# EAGLE design 16A-01 (EAGLE 6.3)
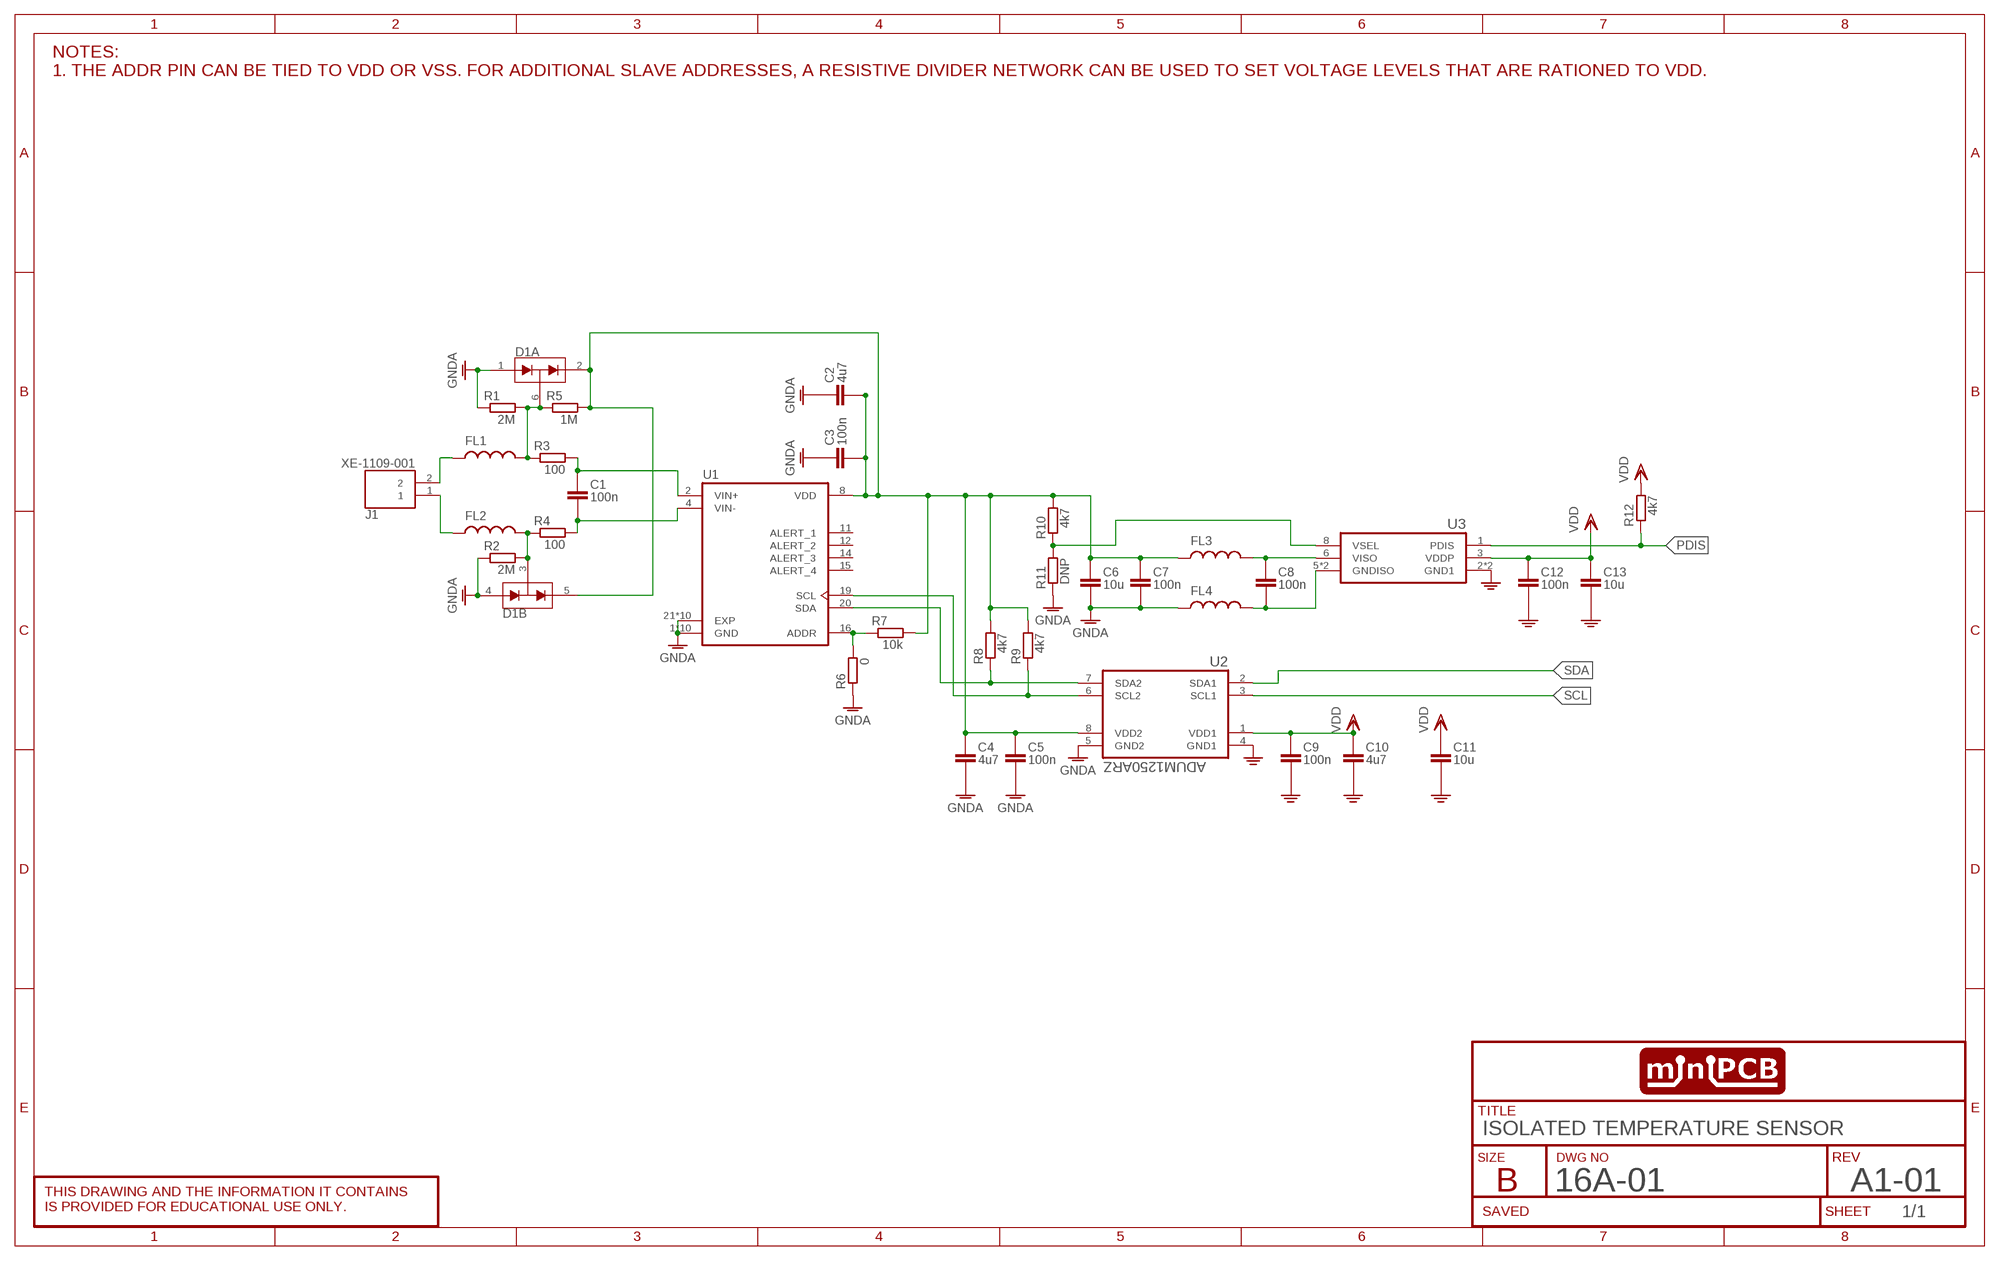
[diagram p0: schematic, sheet 1]
SHEET1 (SCHEMATIC): DWG_NO: 16A-01; REV: A1-01; TITLE: ISOLATED TEMPERATURE SENSOR

## Parts
C1  100n  CAPACITOR0402  [C0402]
C2  4u7  CAPACITOR0402  [C0402]
C3  100n  CAPACITOR0402  [C0402]
C4  4u7  CAPACITOR0402  [C0402]
C5  100n  CAPACITOR0402  [C0402]
C6  10u  CAPACITORSMD  [C0805]
C7  100n  CAPACITOR0402  [C0402]
C8  100n  CAPACITOR0402  [C0402]
C9  100n  CAPACITOR0402  [C0402]
C10  4u7  CAPACITOR0402  [C0402]
C11  10u  CAPACITORSMD  [C0805]
C12  100n  CAPACITOR0402  [C0402]
C13  10u  CAPACITORSMD  [C0805]
D1  SDA004-7  [SOT363]
FL1  BLM03HG601SZ1D  [R0402]
FL2  BLM03HG601SZ1D  [R0402]
FL3  BLM03HG601SZ1D  [R0402]
FL4  BLM03HG601SZ1D  [R0402]
J1  XE-1109-001  [XE-1109-001]
R1  2M  RESISTOR0402  [R0402]
R2  2M  RESISTOR0402  [R0402]
R3  100  RESISTOR0402  [R0402]
R4  100  RESISTOR0402  [R0402]
R5  1M  RESISTOR0402  [R0402]
R6  0  RESISTOR0402  [R0402]
R7  10k  RESISTOR0402  [R0402]
R8  4k7  RESISTOR0402  [R0402]
R9  4k7  RESISTOR0402  [R0402]
R10  4k7  RESISTOR0402  [R0402]
R11  DNP  RESISTOR0402  [R0402]
R12  4k7  RESISTOR0402  [R0402]
U1  MCP9600T-I/MX  [QFN65P500X500X100-21N_MCP9600T-I/MX]
U2  ADUM1250ARZ  [SOIC127P600X175-8N]
U3  ADUM6280  [SOIC127P600X175-8N]

## Nets
GND: C9.2(-) C10.2(-) C11.2ASDF(-) C12.2(-) C13.2ASDF(-) U2.4(GND1) U3.2(GND1) U3.4(GND1)
GNDA: C2.1(+) C3.1(+) C4.2(-) C5.2(-) C6.2ASDF(-) C7.2(-) D1.1(A:A1) D1.4(B:A1) FL4.1 R1.1 R2.1 R6.1 R11.1 U1.1(GND) U1.3(GND) U1.5(GND) U1.6(GND) U1.7(GND) U1.9(GND) U1.10(GND) U1.13(GND) U1.17(GND) U1.18(GND) U1.21(EXP) U1.22(EXP) U1.23(EXP) U1.24(EXP) U1.25(EXP) U1.26(EXP) U1.27(EXP) U1.28(EXP) U1.29(EXP) U1.30(EXP) U2.5(GND2)
N$1: D1.6(A:COM) FL1.2 R1.2 R3.1 R5.1
N$2: R9.1 U1.19(SCL) U2.6(SCL2)
N$3: R8.1 U1.20(SDA) U2.7(SDA2)
N$5: C8.2(-) FL4.2 U3.5(GNDISO) U3.7(GNDISO)
N$6: C8.1(+) FL3.2 U3.6(VISO)
N$7: R10.1 R11.2 U3.8(VSEL)
N$9: R6.2 R7.1 U1.16(ADDR)
N$10: C1.1(+) R3.2 U1.2(VIN+)
N$11: D1.3(B:COM) FL2.2 R2.2 R4.1
N$12: C1.2(-) R4.2 U1.4(VIN-)
N$13: FL1.1 J1.2
N$14: FL2.1 J1.1
PDIS: R12.1 U3.1(PDIS)
SCL: U2.3(SCL1)
SDA: U2.2(SDA1)
VDD: C9.1(+) C10.1(+) C11.1ASD(+) C12.1(+) C13.1ASD(+) R12.2 U2.1(VDD1) U3.3(VDDP)
VISO: C2.2(-) C3.2(-) C4.1(+) C5.1(+) C6.1ASD(+) C7.1(+) D1.2(A:C2) D1.5(B:C2) FL3.1 R5.2 R7.2 R8.2 R9.2 R10.2 U1.8(VDD) U2.8(VDD2)
Unconnected: U1.11(ALERT_1) U1.12(ALERT_2) U1.14(ALERT_3) U1.15(ALERT_4)

## Notes on the sheet
- NOTES:
  1. THE ADDR PIN CAN BE TIED TO VDD OR VSS. FOR ADDITIONAL SLAVE ADDRESSES, A RESISTIVE DIVIDER NETWORK CAN BE USED TO SET VOLTAGE LEVELS THAT ARE RATIONED TO VDD.

## Library data of the parts
C1-C13 = minipcb:CAPACITOR
D1 = minipcb:SDA004-7
FL1-FL4 = minipcb:BLM03HG601SZ1D: Check availability <https://pricing.snapeda.com/parts/BLM03HG601SZ1D/Murata/view-part?ref=eda>
J1 = minipcb:XE-1109-001
R1-R12 = minipcb:RESISTOR
U1 = 16A-01:MCP9600T-I/MX: MCP9600 Series Thermocouple Electromotive Force to ±1.5°C Converter - VQFN-2 Check availability <https://pricing.snapeda.com/parts/MCP9600T-I/MX/Microchip%20Technology/view-part?ref=eda>; AVAILABILITY: In Stock; CHECK_PRICES: https://www.snapeda.com/parts/MCP9600T-I/MX/Microchip/view-part/?ref=eda; DESCRIPTION: IC THRMOCPLE TO DIG CONV 20MQFN; MF: Microchip Technology; MP: MCP9600T-I/MX; PACKAGE: VQFN-20 Microchip; PRICE: None; SNAPEDA_LINK: https://www.snapeda.com/parts/MCP9600T-I/MX/Microchip/view-part/?ref=snap
U2 = 16A-01:ADUM1250ARZ: Hot Swappable, Dual I2C Isolators Check availability <https://pricing.snapeda.com/parts/ADUM1250ARZ/Analog%20Devices/view-part?ref=eda>; AVAILABILITY: In Stock; CHECK_PRICES: https://www.snapeda.com/parts/ADUM1250ARZ/Analog+Devices/view-part/?ref=eda; DESCRIPTION: Hot Swappable Dual I2C Isolator; MF: Analog Devices; MP: ADUM1250ARZ; PACKAGE: SOIC-8 Analog Devices; PRICE: None; SNAPEDA_LINK: https://www.snapeda.com/parts/ADUM1250ARZ/Analog+Devices/view-part/?ref=snap
U3 = 16A-01:ADUM6280

## Board
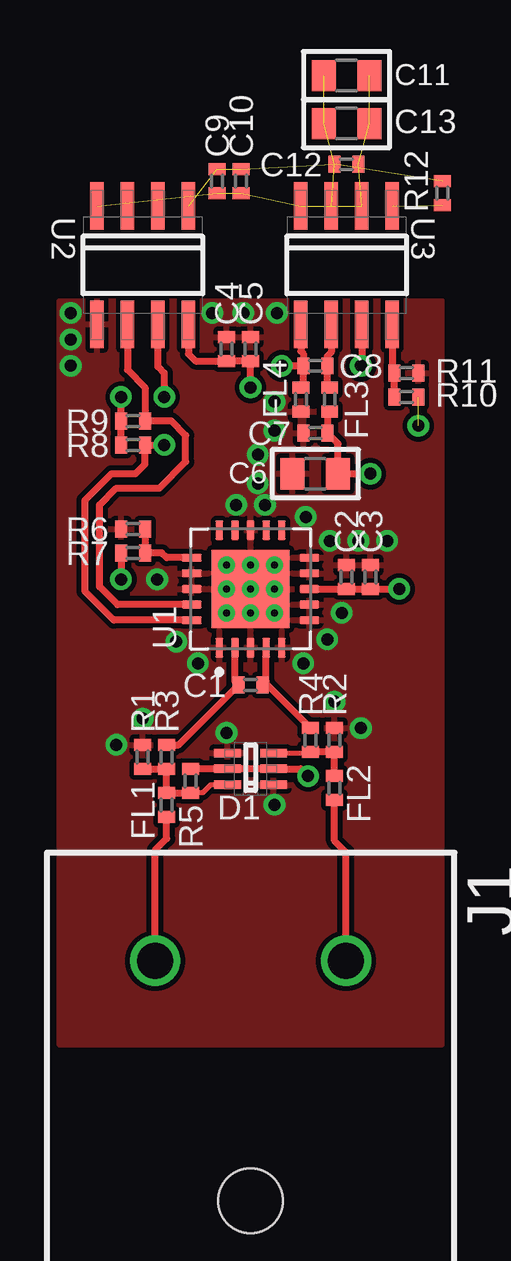
[diagram p1: board, top side]
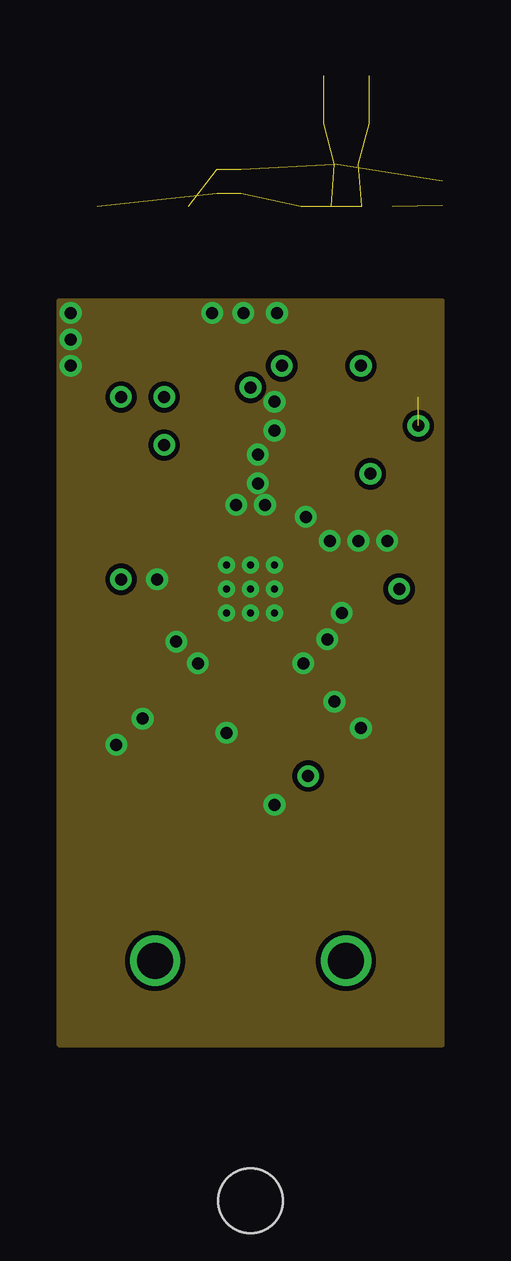
[diagram p2: board, inner layer Route2]
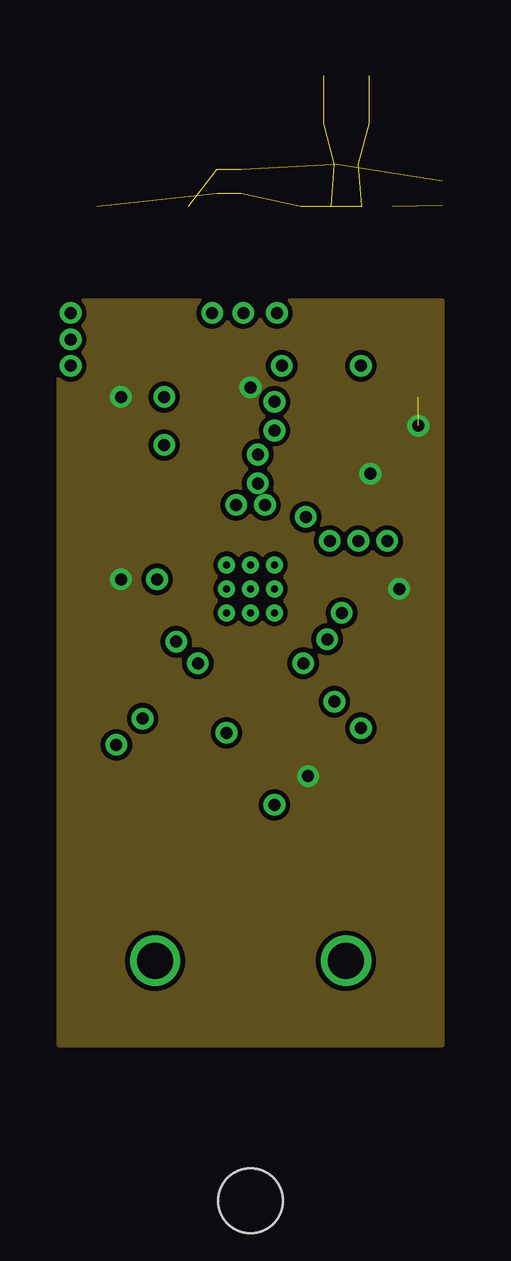
[diagram p3: board, inner layer Route15]
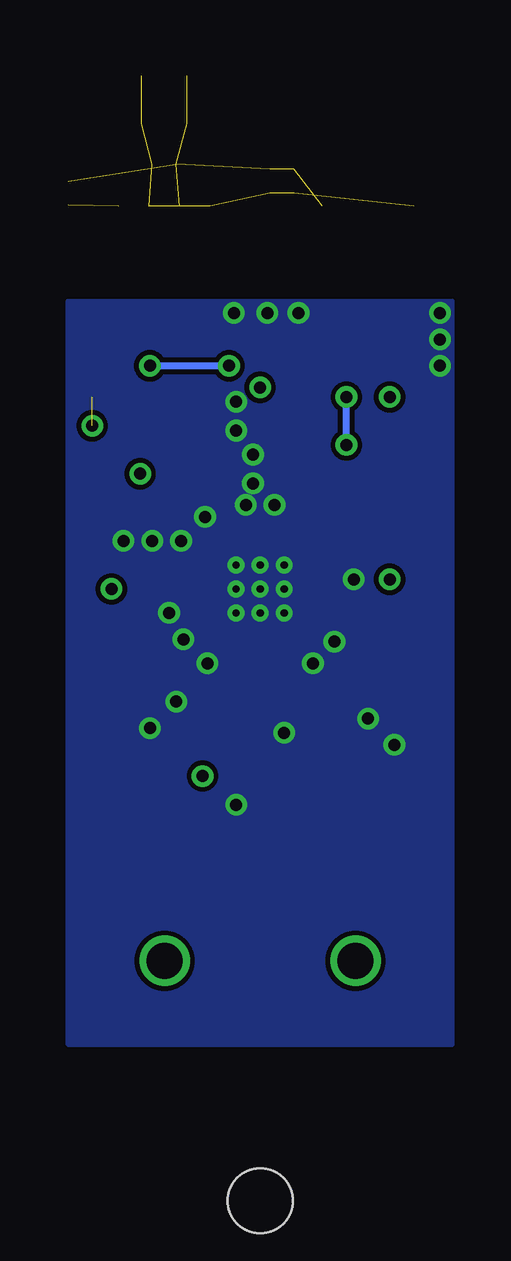
[diagram p4: board, bottom side, seen from below]

No outline drawn. Coordinates in mm, seen from the top.
Copper layers (1+2*15+16): Top 0.035mm / dielectric 0.15mm / Route2 0.035mm / dielectric 0.15mm / Route15 0.035mm / dielectric 0.2mm / Bottom 0.035mm
Design rules "minipcb-SMD *": minimum track width 0.25mm, minimum drill 0.5mm, track to track 0.2mm, track to pad 0.15mm, pad to pad 0.15mm, via to via 0.2mm, smd to smd 0.15mm, copper to edge 1mm, drill to drill 1mm, minimum pad ring 0.2mm, minimum via ring 0.2mm, stop-mask expansion 0.1mm, vias tented up to drill 0.55mm, thermal gap 0.2mm

### Footprints (pad centres in the part's own frame; a part is rotated, then mirrored left to right if it is on the bottom)
C0402 = smd 0.5 x 0.7: 1 -0.5,0; 2 0.5,0
C0805 = smd 1 x 1.3: 1ASD -0.95,0; 2ASDF 0.95,0
SOT363 = smd 1.118 x 0.356: 1 -0.965,0.66; 2 -0.965,0; 3 -0.965,-0.66; 4 0.965,-0.66; 5 0.965,0; 6 0.965,0.66
R0402 = smd 0.5 x 0.7: 1 -0.5,0; 2 0.5,0
XE-1109-001 = drill 1.5: 1 0,3.98; 2 0,-3.98 | hole 2.7: 10,0
QFN65P500X500X100-21N_MCP9600T-I/MX = smd 0.81 x 0.32: 1 -2.45,1.3; 2 -2.45,0.65; 3 -2.45,0; 4 -2.45,-0.65; 5 -2.45,-1.3; 11 2.45,-1.3; 12 2.45,-0.65; 13 2.45,0; 14 2.45,0.65; 15 2.45,1.3 | smd 0.32 x 0.81: 6 -1.3,-2.45; 7 -0.65,-2.45; 8 0,-2.45; 9 0.65,-2.45; 10 1.3,-2.45; 16 1.3,2.45; 17 0.65,2.45; 18 0,2.45; 19 -0.65,2.45; 20 -1.3,2.45 | smd 3.25 x 3.25: 21 0,0 | drill 0.3 pad 0.5: 22 -1,1; 23 0,1; 24 1,1; 25 -1,0; 26 0,0; 27 1,0; 28 -1,-1; 29 0,-1; 30 1,-1
SOIC127P600X175-8N = smd 1.981 x 0.559: 1 -2.464,1.905; 2 -2.464,0.635; 3 -2.464,-0.635; 4 -2.464,-1.905; 5 2.464,-1.905; 6 2.464,-0.635; 7 2.464,0.635; 8 2.464,1.905

### Placement (x,y rotation side)
C1  0,12 0 top
C2  4,16.5 270 top
C3  5,16.5 270 top
C4  -1,26 90 top
C5  0,26 90 top
C6  2.7,20.8 180 top
C7  2.7,22.5 180 top
C8  2.7,25.3 180 top
C9  -1.4,33 270 top
C10  -0.4,33 270 top
C11  4,37.4 0 top
C12  4,33.7 0 top
C13  4,35.4 0 top
D1  0,8.5 180 top
FL1  -3.5,7 90 top
FL2  3.5,7.7 90 top
FL3  3.3,23.9 90 top
FL4  2.1,23.9 90 top
J1  0,0.5 270 top
R1  -4.5,9 270 top
R2  3.5,9.7 270 top
R3  -3.5,9 90 top
R4  2.5,9.7 90 top
R5  -2.5,8 90 top
R6  -4.9,18.5 0 top
R7  -4.9,17.5 180 top
R8  -4.9,22 180 top
R9  -4.9,23 180 top
R10  6.5,24 0 top
R11  6.5,25 180 top
R12  8,32.5 90 top
U1  0,16 90 top
U2  -4.5,29.5 270 top
U3  4,29.5 270 top

### Tracks (layer width: path | path; a pad name or v marks a point on that pad's centre or on a via)
GND  (7 unrouted)
GNDA  (via drill 0.5)
  other vias: -1,10 1,7 1.1,27.5 -1.6,27.5 -0.3,27.5 1,23.8 1,22.6 0.3,21.6 0.3,20.4 -0.6,19.5 0.6,19.5 -7.5,27.5 -7.5,26.4 -7.5,25.3 -3.9,16.4 3.2,13.9 2.2,12.9 -2.2,12.9 -3.1,13.8 3.8,15 2.3,19 3.3,18 4.5,18 5.7,18 4.6,10.2 3.5,11.3 -5.6,9.5 -4.5,10.6
  pour Top: -8,-3 8,-3 8,28 -8,28
  pour Route2: -8,-3 8,-3 8,28 -8,28
  pour Bottom: -8,-3 8,-3 8,28 -8,28
N$1
  Top 0.2: D1.6 -1.66,7.84 -2,7.5 R5.1
  Top 0.3: R1.2 R3.1 FL1.2 R5.1
N$2
  Top 0.3: U1.19 -5.55,15.35 -6.3,16.1 -6.3,19.5 -5.6,20.2 -3.8,20.2 -2.7,21.3 -2.7,22.4 -3.3,23 R9.1 -4.4,24.4 -5.13,25.14 U2.6
N$3  (via drill 0.5)
  Top 0.3: U1.20 -5.7,14.7 -6.9,15.9 -6.9,19.7 -5.8,20.8 -4.8,20.8 -4.4,21.2 R8.1 v-3.6,22 | U2.7 -3.87,25.27 -3.6,25 v-3.6,24
  Bottom 0.3: v-3.6,22 v-3.6,24
N$5  (via drill 0.5)
  Top 0.3: U3.7 4.63,25.34 v4.6,25.3 | v1.3,25.3 C8.2 | U3.5 2.1,25.91 2.2,25.8 C8.2 | FL4.2 2.2,24.5 C8.2
  Bottom 0.3: v4.6,25.3 v1.3,25.3
N$6
  Top 0.3: FL3.2 3.2,24.5 C8.1 3.2,25.7 3.37,25.86 U3.6
N$7
  Top 0.3: U3.8 5.91,25.09 R11.2 R10.1
N$9
  Top 0.3: R6.2 R7.1 -3.7,17.5 -3.5,17.3 U1.16
N$10
  Top 0.3: R3.2 -3,9.5 C1.1 -0.65,12.15 U1.2
N$11
  Top 0.2: D1.3 2.46,9.16 R4.1
  Top 0.3: FL2.2 R2.2 R4.1
N$12
  Top 0.3: R4.2 0.7,12 C1.2 0.65,12.15 U1.4
N$13
  Top 0.3: J1.2 -3.98,5.12 -3.5,5.6 FL1.1
N$14
  Top 0.3: J1.1 3.98,5.02 3.5,5.5 FL2.1
PDIS  (1 unrouted)
VDD  (7 unrouted)
VISO  (via drill 0.5)  (1 unrouted)
  Top 0.3: v2.4,8.2 2.1,8.5 D1.2 D1.5 R5.2 | R8.2 R9.2 v-5.4,24 | R7.2 v-5.4,16.4 | U1.8 C2.2 C3.2 v6.2,16 | FL3.1 3.2,23.3 C7.1 3.65,22.05 C6.1ASD v5,20.8 | U2.8 -2.6,25.8 -2.3,25.5 C4.1 C5.1 v0,24.4
  other vias: 7,22.8
  pour Route15: -8,-3 8,-3 8,28 -8,28